# EAGLE schematic M1125X (EAGLE 6.6.0)
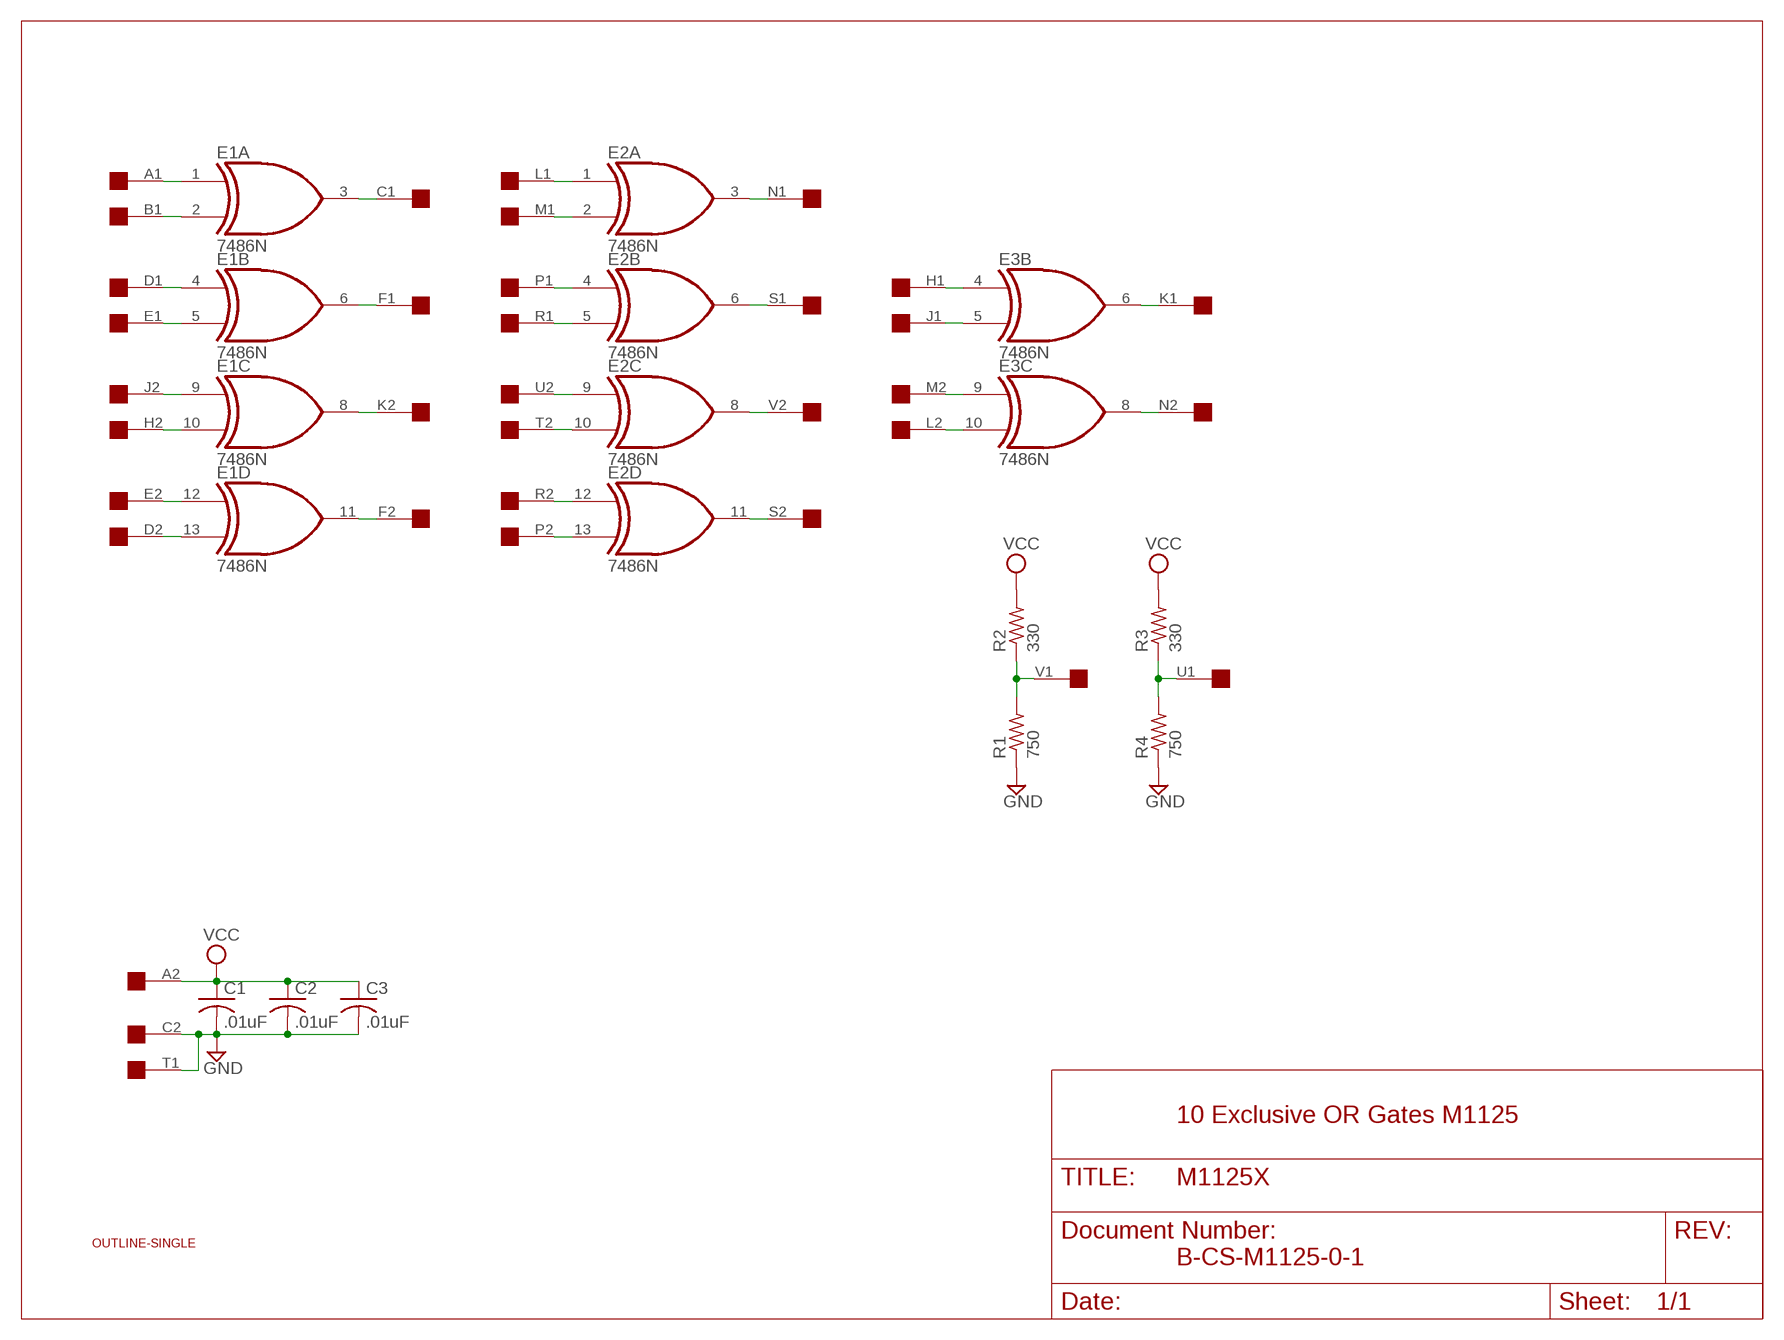
[diagram p0: schematic, sheet 1]

## Parts
C1  .01uF  C-US075-032X103  [C075-032X103]
C2  .01uF  C-US075-032X103  [C075-032X103]
C3  .01uF  C-US075-032X103  [C075-032X103]
E1  7486N  [DIL14]
E2  7486N  [DIL14]
E3  7486N  [DIL14]
R1  750  R-US_0207/10  [0207/10]
R2  330  R-US_0207/10  [0207/10]
R3  330  R-US_0207/10  [0207/10]
R4  750  R-US_0207/10  [0207/10]
U$1  OUTLINE-SINGLE  [SINGLE]
U$2  SINGLE  [EDGE-CON2]

## Nets
GND: C1.2 C2.2 C3.2 R1.1 R4.1 U$2.C2 U$2.T1
N$1: E2.9(C:I0) U$2.U2
N$2: E2.10(C:I1) U$2.T2
N$3: E2.12(D:I0) U$2.R2
N$4: E2.13(D:I1) U$2.P2
N$5: E2.11(D:O) U$2.S2
N$6: E2.8(C:O) U$2.V2
N$7: E1.13(D:I1) U$2.D2
N$8: E1.12(D:I0) U$2.E2
N$9: E1.10(C:I1) U$2.H2
N$10: E1.9(C:I0) U$2.J2
N$11: E1.8(C:O) U$2.K2
N$12: E1.11(D:O) U$2.F2
N$13: E3.10(C:I1) U$2.L2
N$14: E3.9(C:I0) U$2.M2
N$15: E3.8(C:O) U$2.N2
N$16: R1.2 R2.1 U$2.V1
N$17: R3.1 R4.2 U$2.U1
N$18: E1.2(A:I1) U$2.B1
N$19: E1.1(A:I0) U$2.A1
N$20: E1.3(A:O) U$2.C1
N$21: E1.6(B:O) U$2.F1
N$22: E1.4(B:I0) U$2.D1
N$23: E1.5(B:I1) U$2.E1
N$24: E3.5(B:I1) U$2.J1
N$25: E3.4(B:I0) U$2.H1
N$26: E3.6(B:O) U$2.K1
N$27: E2.6(B:O) U$2.S1
N$28: E2.3(A:O) U$2.N1
N$29: E2.1(A:I0) U$2.L1
N$30: E2.2(A:I1) U$2.M1
N$31: E2.4(B:I0) U$2.P1
N$32: E2.5(B:I1) U$2.R1
VCC: C1.1 C2.1 C3.1 R2.2 R3.2 U$2.A2
Unconnected: E3.1(A:I0) E3.2(A:I1) E3.3(A:O) E3.11(D:O) E3.12(D:I0) E3.13(D:I1) U$2.B2

## Notes on the sheet
- 10 Exclusive OR Gates M1125
- B-CS-M1125-0-1

## Power pins joined to a net without a drawn wire
GND: E1.7(P:GND) E2.7(P:GND) E3.7(P:GND)
VCC: E1.14(P:VCC) E2.14(P:VCC) E3.14(P:VCC)

## Library data of the parts
C1-C3 = rcl:C-US: CAPACITOR, American symbol
E1-E3 = 74xx-us:74*86: Quad 2-input EXCLUSIV-OR (XOR) gate
R1-R4 = rcl:R-US_: RESISTOR, American symbol
U$1 = dec-con:OUTLINE-*: Board outlines for DEC boards.
U$2 = dec-con:SINGLE: Single-Height DEC board

## Net classes
0 default: width 0.813 mm